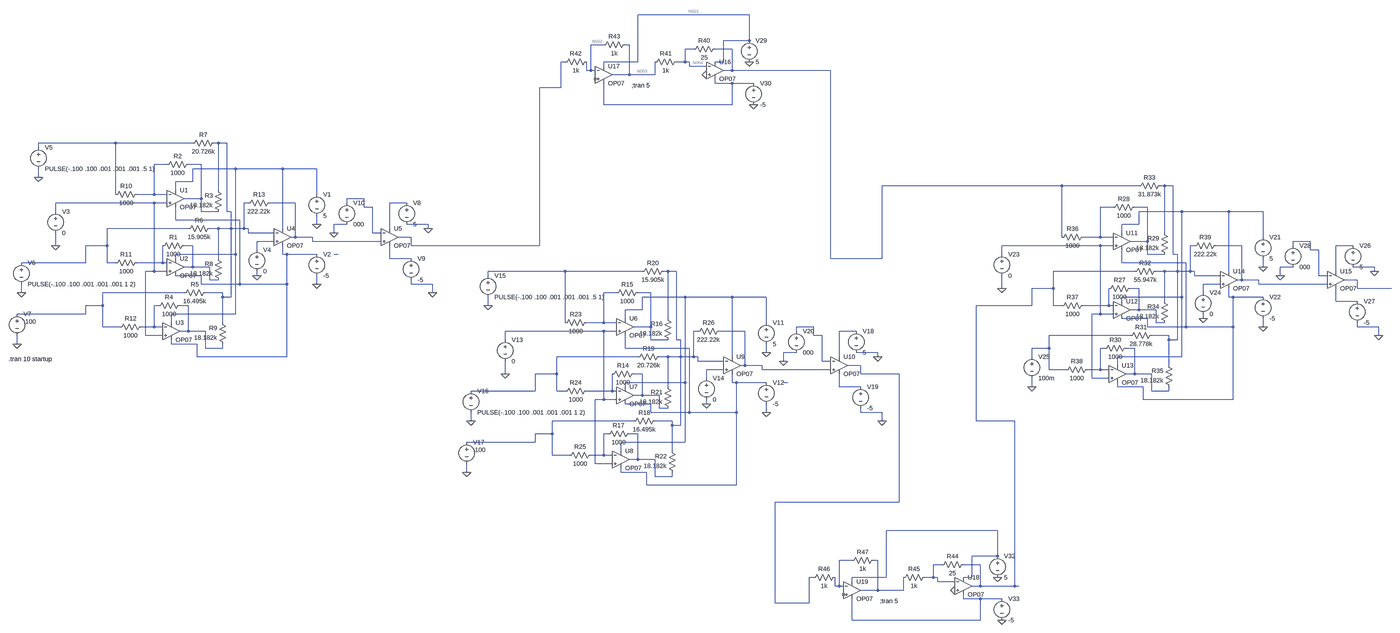
[diagram p0: schematic xor_with_resistor.asc, whole sheet]
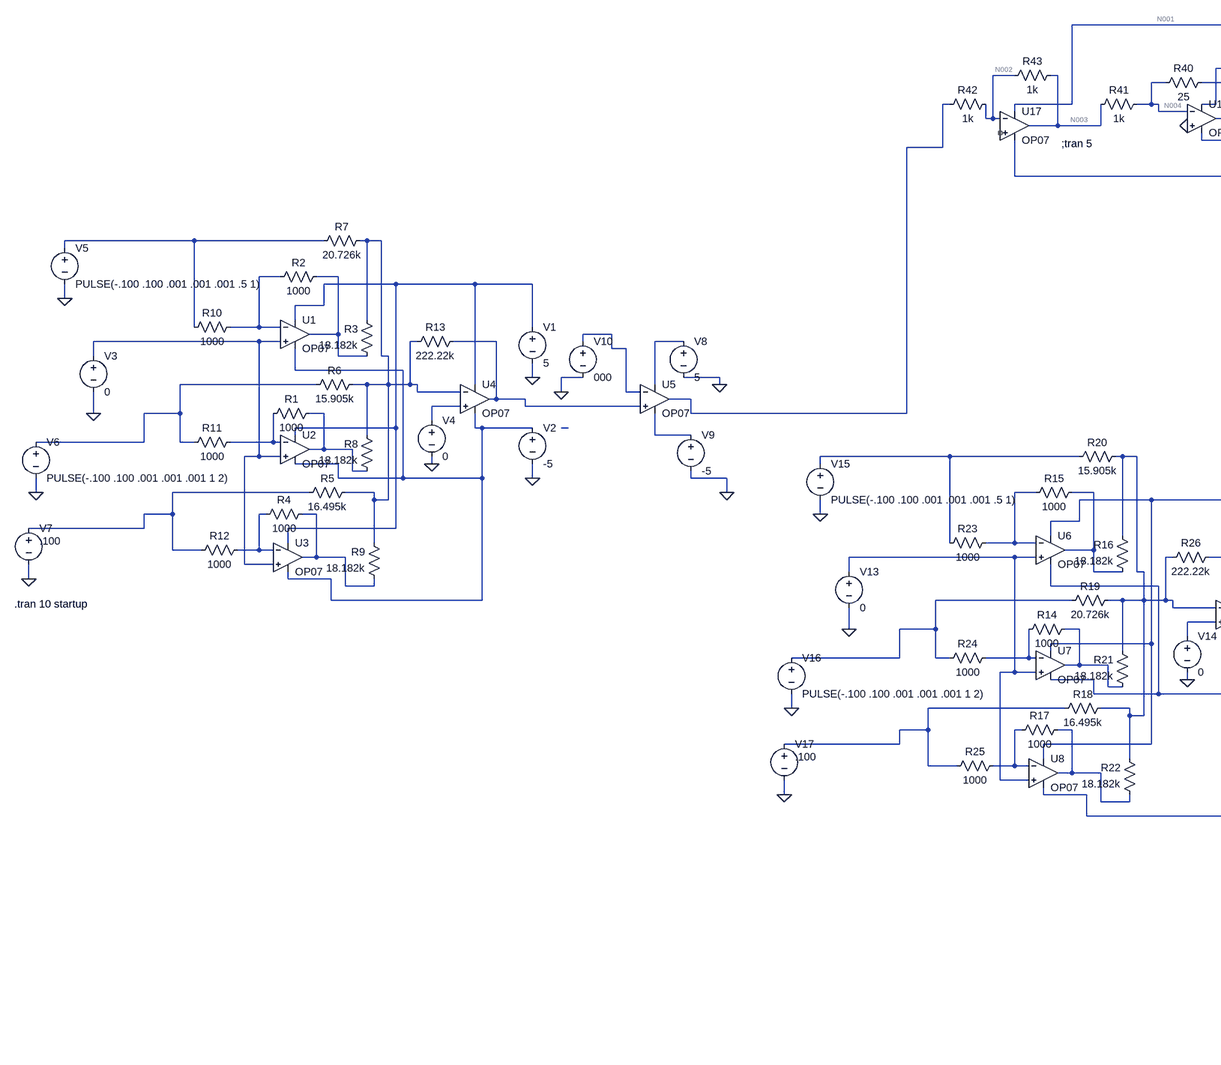
[diagram p1: schematic xor_with_resistor.asc, part, row 1 of 1, column 1 of 2]
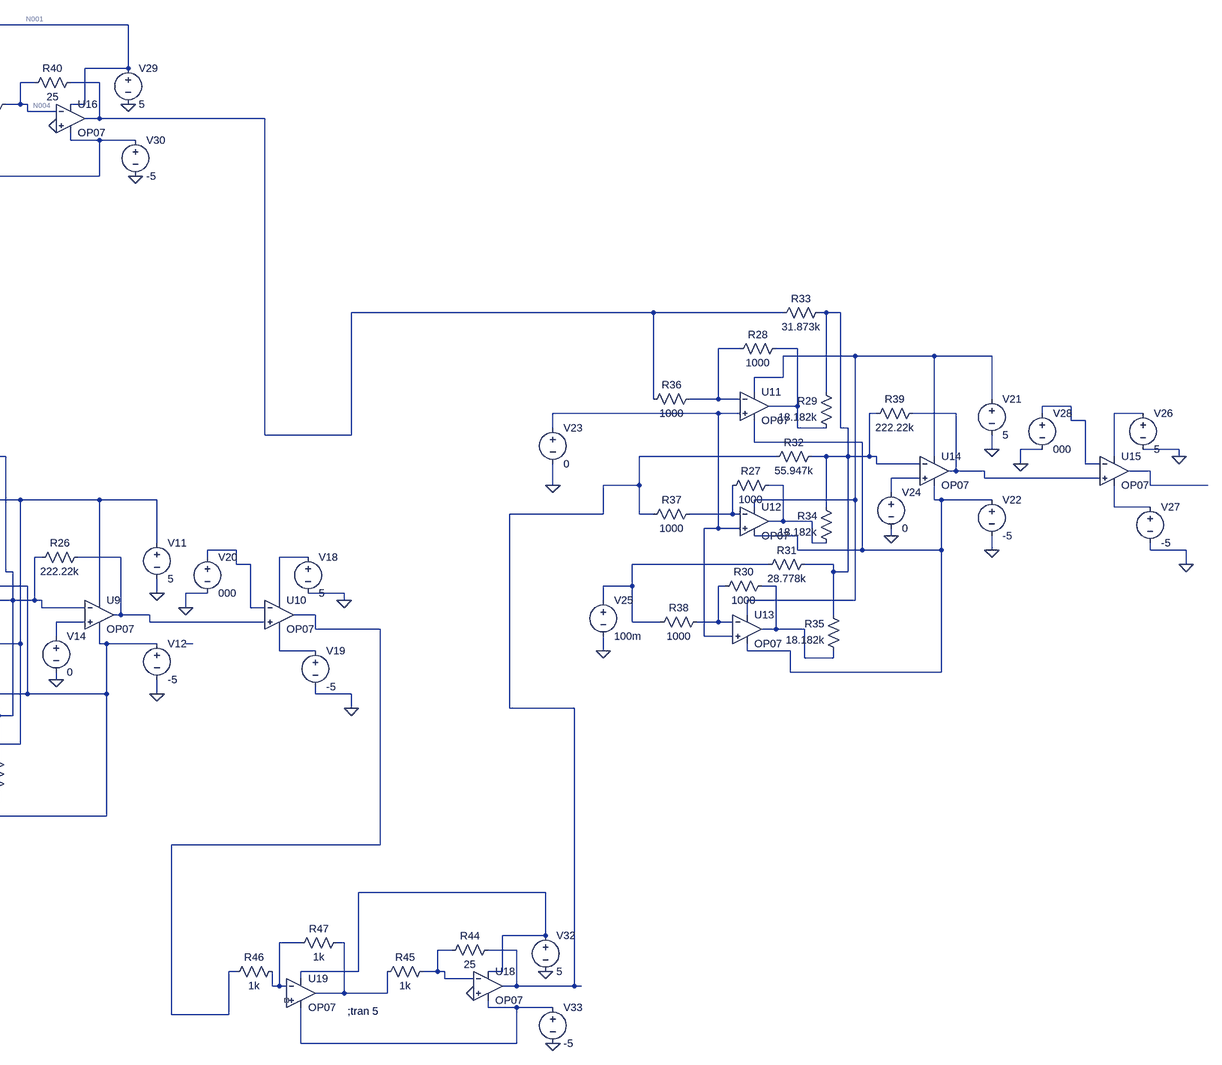
[diagram p2: schematic xor_with_resistor.asc, part, row 1 of 1, column 2 of 2]
xor_with_resistor.asc, the LTspice schematic file:
Version 4
SHEET 1 3268 1156
WIRE 864 -1184 448 -1184
WIRE 864 -1088 864 -1184
WIRE 864 -1088 768 -1088
WIRE 320 -1072 272 -1072
WIRE 416 -1072 400 -1072
WIRE 656 -1056 624 -1056
WIRE 800 -1056 736 -1056
WIRE 176 -1008 160 -1008
WIRE 448 -1008 448 -1184
WIRE 448 -1008 320 -1008
WIRE 624 -1008 624 -1056
WIRE 624 -1008 592 -1008
WIRE 640 -1008 624 -1008
WIRE 768 -1008 768 -1088
WIRE 768 -1008 736 -1008
WIRE 320 -992 320 -1008
WIRE 640 -992 640 -1008
WIRE 704 -992 640 -992
WIRE 256 -976 256 -1008
WIRE 272 -976 272 -1072
WIRE 272 -976 256 -976
WIRE 288 -976 272 -976
WIRE 800 -976 800 -1056
WIRE 800 -976 768 -976
WIRE 1168 -976 800 -976
WIRE 416 -960 416 -1072
WIRE 416 -960 352 -960
WIRE 512 -960 512 -1008
WIRE 512 -960 416 -960
WIRE 736 -928 736 -944
WIRE 800 -928 736 -928
WIRE 880 -928 800 -928
WIRE 160 -912 160 -1008
WIRE 160 -912 80 -912
WIRE 320 -848 320 -928
WIRE 800 -848 800 -928
WIRE 800 -848 320 -848
WIRE -1504 -704 -1792 -704
WIRE -1216 -704 -1504 -704
WIRE -1120 -704 -1136 -704
WIRE -1088 -704 -1120 -704
WIRE -1792 -688 -1792 -704
WIRE -1312 -624 -1360 -624
WIRE -1184 -624 -1232 -624
WIRE -1056 -608 -1216 -608
WIRE -880 -608 -1056 -608
WIRE -752 -608 -880 -608
WIRE -1792 -576 -1792 -608
WIRE -1216 -560 -1216 -608
WIRE -1216 -560 -1280 -560
WIRE 2032 -544 1360 -544
WIRE 2320 -544 2032 -544
WIRE 2416 -544 2400 -544
WIRE 2448 -544 2416 -544
WIRE -1280 -528 -1280 -560
WIRE -1120 -528 -1120 -704
WIRE -1504 -512 -1504 -704
WIRE -1360 -512 -1360 -624
WIRE -1360 -512 -1424 -512
WIRE -1312 -512 -1360 -512
WIRE -752 -512 -752 -608
WIRE -1184 -496 -1184 -624
WIRE -1184 -496 -1248 -496
WIRE -576 -496 -640 -496
WIRE -1360 -480 -1728 -480
WIRE -1312 -480 -1360 -480
WIRE -1008 -480 -1024 -480
WIRE -832 -480 -928 -480
WIRE -640 -480 -640 -496
WIRE -416 -480 -480 -480
WIRE -576 -464 -576 -496
WIRE -544 -464 -576 -464
WIRE 2224 -464 2176 -464
WIRE 2352 -464 2304 -464
WIRE -1728 -448 -1728 -480
WIRE -1184 -448 -1184 -496
WIRE -1120 -448 -1184 -448
WIRE -1088 -448 -1088 -704
WIRE -1072 -448 -1088 -448
WIRE 2480 -448 2320 -448
WIRE 2656 -448 2480 -448
WIRE 2784 -448 2656 -448
WIRE -1280 -416 -1280 -464
WIRE -1040 -416 -1280 -416
WIRE -752 -400 -752 -432
WIRE -640 -400 -688 -400
WIRE -336 -400 -416 -400
WIRE 2320 -400 2320 -448
WIRE 2320 -400 2256 -400
WIRE -1232 -384 -1536 -384
WIRE -1120 -384 -1152 -384
WIRE -1072 -384 -1072 -448
WIRE -1072 -384 -1120 -384
WIRE -1024 -384 -1024 -480
WIRE -1024 -384 -1072 -384
WIRE -1008 -384 -1024 -384
WIRE -880 -384 -880 -608
WIRE -480 -384 -480 -480
WIRE -336 -384 -336 -400
WIRE -1008 -368 -1008 -384
WIRE -912 -368 -1008 -368
WIRE -688 -368 -688 -400
WIRE -544 -368 -544 -464
WIRE -512 -368 -544 -368
WIRE 2256 -368 2256 -400
WIRE 2416 -368 2416 -544
WIRE -832 -352 -832 -480
WIRE -832 -352 -848 -352
WIRE -768 -352 -832 -352
WIRE -400 -352 -448 -352
WIRE 2032 -352 2032 -544
WIRE 2176 -352 2176 -464
WIRE 2176 -352 2112 -352
WIRE 2224 -352 2176 -352
WIRE 2784 -352 2784 -448
WIRE -912 -336 -976 -336
WIRE -768 -336 -768 -352
WIRE -512 -336 -768 -336
WIRE 2352 -336 2352 -464
WIRE 2352 -336 2288 -336
WIRE 2960 -336 2896 -336
WIRE -1728 -320 -1728 -368
WIRE -1536 -320 -1536 -384
WIRE -1536 -320 -1616 -320
WIRE -1216 -320 -1248 -320
WIRE -400 -320 -400 -352
WIRE 80 -320 80 -912
WIRE 80 -320 -400 -320
WIRE 2176 -320 1808 -320
WIRE 2224 -320 2176 -320
WIRE 2528 -320 2512 -320
WIRE 2704 -320 2608 -320
WIRE 2896 -320 2896 -336
WIRE 3120 -320 3056 -320
WIRE -976 -304 -976 -336
WIRE 2960 -304 2960 -336
WIRE 2992 -304 2960 -304
WIRE -1056 -288 -1056 -608
WIRE -1056 -288 -1280 -288
WIRE -880 -288 -880 -320
WIRE -864 -288 -880 -288
WIRE -752 -288 -864 -288
WIRE -672 -288 -688 -288
WIRE 1808 -288 1808 -320
WIRE 2352 -288 2352 -336
WIRE 2416 -288 2352 -288
WIRE 2448 -288 2448 -544
WIRE 2464 -288 2448 -288
WIRE -1280 -272 -1280 -288
WIRE -1120 -272 -1120 -384
WIRE -480 -272 -480 -320
WIRE -400 -272 -480 -272
WIRE 1168 -272 1168 -976
WIRE 1360 -272 1360 -544
WIRE 1360 -272 1168 -272
WIRE -1616 -256 -1616 -320
WIRE -1616 -256 -1856 -256
WIRE -1536 -256 -1536 -320
WIRE -1504 -256 -1536 -256
WIRE -1328 -256 -1328 -320
WIRE -1328 -256 -1424 -256
WIRE -1312 -256 -1328 -256
WIRE 2256 -256 2256 -304
WIRE 2496 -256 2256 -256
WIRE -1216 -240 -1216 -320
WIRE -1216 -240 -1248 -240
WIRE -1152 -240 -1216 -240
WIRE 2784 -240 2784 -272
WIRE 2896 -240 2848 -240
WIRE 3200 -240 3120 -240
WIRE -1360 -224 -1360 -480
WIRE -1360 -224 -1392 -224
WIRE -1312 -224 -1360 -224
WIRE 176 -224 -112 -224
WIRE 464 -224 176 -224
WIRE 560 -224 544 -224
WIRE 592 -224 560 -224
WIRE 2304 -224 2000 -224
WIRE 2416 -224 2384 -224
WIRE 2464 -224 2464 -288
WIRE 2464 -224 2416 -224
WIRE 2512 -224 2512 -320
WIRE 2512 -224 2464 -224
WIRE 2528 -224 2512 -224
WIRE 2656 -224 2656 -448
WIRE 3056 -224 3056 -320
WIRE 3200 -224 3200 -240
WIRE -1184 -208 -1280 -208
WIRE -976 -208 -976 -224
WIRE -112 -208 -112 -224
WIRE 2528 -208 2528 -224
WIRE 2624 -208 2528 -208
WIRE 2848 -208 2848 -240
WIRE 2992 -208 2992 -304
WIRE 3024 -208 2992 -208
WIRE -1152 -192 -1152 -240
WIRE -1120 -192 -1152 -192
WIRE 2704 -192 2704 -320
WIRE 2704 -192 2688 -192
WIRE 2768 -192 2704 -192
WIRE 3136 -192 3088 -192
WIRE -1184 -176 -1184 -208
WIRE -1040 -176 -1040 -416
WIRE -1040 -176 -1184 -176
WIRE -864 -176 -864 -288
WIRE -864 -176 -1040 -176
WIRE -752 -176 -752 -208
WIRE -400 -176 -400 -192
WIRE -320 -176 -400 -176
WIRE 2624 -176 2560 -176
WIRE 2768 -176 2768 -192
WIRE 3024 -176 2768 -176
WIRE 1808 -160 1808 -208
WIRE 2000 -160 2000 -224
WIRE 2000 -160 1920 -160
WIRE 2320 -160 2288 -160
WIRE 3136 -160 3136 -192
WIRE 3264 -160 3136 -160
WIRE -1856 -144 -1856 -176
WIRE -1248 -144 -1552 -144
WIRE -1104 -144 -1168 -144
WIRE -320 -144 -320 -176
WIRE 368 -144 320 -144
WIRE 496 -144 448 -144
WIRE 2560 -144 2560 -176
WIRE -1104 -128 -1104 -144
WIRE -1072 -128 -1072 -384
WIRE -1072 -128 -1104 -128
WIRE 624 -128 464 -128
WIRE 800 -128 624 -128
WIRE 928 -128 800 -128
WIRE 2480 -128 2480 -448
WIRE 2480 -128 2256 -128
WIRE 2656 -128 2656 -160
WIRE 2672 -128 2656 -128
WIRE 2784 -128 2672 -128
WIRE 2256 -112 2256 -128
WIRE 2416 -112 2416 -224
WIRE 3056 -112 3056 -160
WIRE 3136 -112 3056 -112
WIRE -1552 -96 -1552 -144
WIRE -1552 -96 -1616 -96
WIRE -1344 -96 -1360 -96
WIRE -1232 -96 -1264 -96
WIRE -112 -96 -112 -128
WIRE 1920 -96 1920 -160
WIRE 1920 -96 1712 -96
WIRE 2000 -96 2000 -160
WIRE 2032 -96 2000 -96
WIRE 2208 -96 2208 -160
WIRE 2208 -96 2112 -96
WIRE 2224 -96 2208 -96
WIRE 464 -80 464 -128
WIRE 464 -80 400 -80
WIRE 2320 -80 2320 -160
WIRE 2320 -80 2288 -80
WIRE 2384 -80 2320 -80
WIRE -1616 -64 -1616 -96
WIRE -1616 -64 -1872 -64
WIRE -1056 -64 -1056 -288
WIRE -1056 -64 -1296 -64
WIRE 2176 -64 2176 -320
WIRE 2176 -64 2144 -64
WIRE 2224 -64 2176 -64
WIRE 400 -48 400 -80
WIRE 560 -48 560 -224
WIRE 2352 -48 2256 -48
WIRE 2560 -48 2560 -64
WIRE -1296 -32 -1296 -64
WIRE -1104 -32 -1104 -128
WIRE 176 -32 176 -224
WIRE 320 -32 320 -144
WIRE 320 -32 256 -32
WIRE 368 -32 320 -32
WIRE 928 -32 928 -128
WIRE 2384 -32 2384 -80
WIRE 2416 -32 2384 -32
WIRE -1552 -16 -1552 -96
WIRE -1488 -16 -1552 -16
WIRE -1360 -16 -1360 -96
WIRE -1360 -16 -1408 -16
WIRE -1328 -16 -1360 -16
WIRE 496 -16 496 -144
WIRE 496 -16 432 -16
WIRE 1104 -16 1040 -16
WIRE 2352 -16 2352 -48
WIRE 2496 -16 2496 -256
WIRE 2496 -16 2352 -16
WIRE 2672 -16 2672 -128
WIRE 2672 -16 2496 -16
WIRE 2784 -16 2784 -48
WIRE 3136 -16 3136 -32
WIRE 3216 -16 3136 -16
WIRE -1232 0 -1232 -96
WIRE -1232 0 -1264 0
WIRE -1168 0 -1232 0
WIRE 320 0 -48 0
WIRE 368 0 320 0
WIRE 672 0 656 0
WIRE 848 0 752 0
WIRE 1040 0 1040 -16
WIRE 1264 0 1200 0
WIRE -1392 16 -1392 -224
WIRE -1328 16 -1392 16
WIRE 1104 16 1104 -16
WIRE 1136 16 1104 16
WIRE 2288 16 1984 16
WIRE 2432 16 2368 16
WIRE 3216 16 3216 -16
WIRE -48 32 -48 0
WIRE 496 32 496 -16
WIRE 560 32 496 32
WIRE 592 32 592 -224
WIRE 608 32 592 32
WIRE 2432 32 2432 16
WIRE 2464 32 2464 -224
WIRE 2464 32 2432 32
WIRE -1872 48 -1872 16
WIRE -1296 48 -1296 32
WIRE -1200 48 -1296 48
WIRE -1168 64 -1168 0
WIRE -1104 64 -1104 48
WIRE -1104 64 -1168 64
WIRE 400 64 400 16
WIRE 640 64 400 64
WIRE 1984 64 1984 16
WIRE 1984 64 1920 64
WIRE 2192 64 2176 64
WIRE 2304 64 2272 64
WIRE 928 80 928 48
WIRE 1040 80 992 80
WIRE 1344 80 1264 80
WIRE -1200 96 -1200 48
WIRE -864 96 -864 -176
WIRE -864 96 -1200 96
WIRE 448 96 144 96
WIRE 560 96 528 96
WIRE 608 96 608 32
WIRE 608 96 560 96
WIRE 656 96 656 0
WIRE 656 96 608 96
WIRE 672 96 656 96
WIRE 800 96 800 -128
WIRE 1200 96 1200 0
WIRE 1344 96 1344 80
WIRE 1920 96 1920 64
WIRE 2480 96 2480 -128
WIRE 2480 96 2240 96
WIRE 672 112 672 96
WIRE 768 112 672 112
WIRE 992 112 992 80
WIRE 1136 112 1136 16
WIRE 1168 112 1136 112
WIRE 848 128 848 0
WIRE 848 128 832 128
WIRE 912 128 848 128
WIRE 1280 128 1232 128
WIRE 2240 128 2240 96
WIRE 2432 128 2432 32
WIRE 768 144 704 144
WIRE 912 144 912 128
WIRE 1168 144 912 144
WIRE 1984 144 1984 64
WIRE 2048 144 1984 144
WIRE 2176 144 2176 64
WIRE 2176 144 2128 144
WIRE 2208 144 2176 144
WIRE -48 160 -48 112
WIRE 144 160 144 96
WIRE 144 160 64 160
WIRE 464 160 432 160
WIRE 1280 160 1280 128
WIRE 1424 160 1280 160
WIRE 2304 160 2304 64
WIRE 2304 160 2272 160
WIRE 2368 160 2304 160
WIRE 704 176 704 144
WIRE 2144 176 2144 -64
WIRE 2208 176 2144 176
WIRE 624 192 624 -128
WIRE 624 192 400 192
WIRE 800 192 800 160
WIRE 816 192 800 192
WIRE 928 192 816 192
WIRE 1008 192 992 192
WIRE 400 208 400 192
WIRE 560 208 560 96
WIRE 1200 208 1200 160
WIRE 1280 208 1200 208
WIRE 1920 208 1920 176
WIRE 2240 208 2240 192
WIRE 2336 208 2240 208
WIRE 64 224 64 160
WIRE 64 224 -176 224
WIRE 144 224 144 160
WIRE 176 224 144 224
WIRE 352 224 352 160
WIRE 352 224 256 224
WIRE 368 224 352 224
WIRE 2368 224 2368 160
WIRE 2432 224 2432 208
WIRE 2432 224 2368 224
WIRE 464 240 464 160
WIRE 464 240 432 240
WIRE 528 240 464 240
WIRE 320 256 320 0
WIRE 320 256 288 256
WIRE 368 256 320 256
WIRE 2336 256 2336 208
WIRE 2672 256 2672 -16
WIRE 2672 256 2336 256
WIRE 496 272 400 272
WIRE 704 272 704 256
WIRE 528 288 528 240
WIRE 560 288 528 288
WIRE 496 304 496 272
WIRE 640 304 640 64
WIRE 640 304 496 304
WIRE 816 304 816 192
WIRE 816 304 640 304
WIRE 928 304 928 272
WIRE 1280 304 1280 288
WIRE 1360 304 1280 304
WIRE -176 336 -176 304
WIRE 432 336 128 336
WIRE 576 336 512 336
WIRE 1360 336 1360 304
WIRE 1712 336 1712 -96
WIRE 1856 336 1712 336
WIRE 576 352 576 336
WIRE 608 352 608 96
WIRE 608 352 576 352
WIRE 128 384 128 336
WIRE 128 384 64 384
WIRE 336 384 320 384
WIRE 448 384 416 384
WIRE 64 416 64 384
WIRE 64 416 -192 416
WIRE 624 416 624 192
WIRE 624 416 384 416
WIRE 384 448 384 416
WIRE 576 448 576 352
WIRE 128 464 128 384
WIRE 192 464 128 464
WIRE 320 464 320 384
WIRE 320 464 272 464
WIRE 352 464 320 464
WIRE 448 480 448 384
WIRE 448 480 416 480
WIRE 512 480 448 480
WIRE 288 496 288 256
WIRE 352 496 288 496
WIRE -192 528 -192 496
WIRE 384 528 384 512
WIRE 480 528 384 528
WIRE 512 544 512 480
WIRE 576 544 576 528
WIRE 576 544 512 544
WIRE 480 576 480 528
WIRE 816 576 816 304
WIRE 816 576 480 576
WIRE 1424 640 1424 160
WIRE 1424 640 960 640
WIRE 1792 784 1376 784
WIRE 1792 880 1792 784
WIRE 1792 880 1696 880
WIRE 1248 896 1200 896
WIRE 1344 896 1328 896
WIRE 1584 912 1552 912
WIRE 1728 912 1664 912
WIRE 1104 960 1088 960
WIRE 1376 960 1376 784
WIRE 1376 960 1248 960
WIRE 1552 960 1552 912
WIRE 1552 960 1520 960
WIRE 1568 960 1552 960
WIRE 1696 960 1696 880
WIRE 1696 960 1664 960
WIRE 1248 976 1248 960
WIRE 1568 976 1568 960
WIRE 1632 976 1568 976
WIRE 1184 992 1184 960
WIRE 1200 992 1200 896
WIRE 1200 992 1184 992
WIRE 1216 992 1200 992
WIRE 1728 992 1728 912
WIRE 1728 992 1696 992
WIRE 1856 992 1856 336
WIRE 1856 992 1728 992
WIRE 1872 992 1856 992
WIRE 1344 1008 1344 896
WIRE 1344 1008 1280 1008
WIRE 1440 1008 1440 960
WIRE 1440 1008 1344 1008
WIRE 1664 1040 1664 1024
WIRE 1728 1040 1664 1040
WIRE 1808 1040 1728 1040
WIRE 960 1056 960 640
WIRE 1088 1056 1088 960
WIRE 1088 1056 960 1056
WIRE 1248 1120 1248 1040
WIRE 1728 1120 1728 1040
WIRE 1728 1120 1248 1120
FLAG -752 -400 0
FLAG -752 -176 0
FLAG -1728 -320 0
FLAG -976 -208 0
FLAG -1792 -576 0
FLAG -1856 -144 0
FLAG -1872 48 0
FLAG -336 -384 0
FLAG -320 -144 0
FLAG -688 -368 0
FLAG 928 80 0
FLAG 928 304 0
FLAG -48 160 0
FLAG 704 272 0
FLAG -112 -96 0
FLAG -176 336 0
FLAG -192 528 0
FLAG 1344 96 0
FLAG 1360 336 0
FLAG 992 112 0
FLAG 2784 -240 0
FLAG 2784 -16 0
FLAG 1808 -160 0
FLAG 2560 -48 0
FLAG 3200 -224 0
FLAG 3216 16 0
FLAG 2848 -208 0
FLAG 1920 208 0
FLAG 864 -1008 0
FLAG 880 -848 0
FLAG 704 -960 0
FLAG 1792 960 0
FLAG 1808 1120 0
FLAG 1632 1008 0
SYMBOL Opamps\\OP07 -1280 -560 R0
SYMATTR InstName U1
SYMBOL Opamps\\OP07 -1280 -304 R0
SYMATTR InstName U2
SYMBOL Opamps\\OP07 -1296 -64 R0
SYMATTR InstName U3
SYMBOL Opamps\\OP07 -880 -416 R0
SYMATTR InstName U4
SYMBOL voltage -752 -528 R0
WINDOW 123 0 0 Left 2
WINDOW 39 0 0 Left 2
SYMATTR InstName V1
SYMATTR Value 5
SYMBOL voltage -752 -304 R0
WINDOW 123 0 0 Left 2
WINDOW 39 0 0 Left 2
SYMATTR InstName V2
SYMATTR Value -5
SYMBOL res -1232 -336 R90
WINDOW 0 0 56 VBottom 2
WINDOW 3 32 56 VTop 2
SYMATTR InstName R1
SYMATTR Value 1000
SYMBOL res -1216 -640 R90
WINDOW 0 0 56 VBottom 2
WINDOW 3 32 56 VTop 2
SYMATTR InstName R2
SYMATTR Value 1000
SYMBOL res -1104 -432 R180
WINDOW 0 36 76 Left 2
WINDOW 3 36 40 Left 2
SYMATTR InstName R3
SYMATTR Value 18.182k
SYMBOL res -1248 -112 R90
WINDOW 0 0 56 VBottom 2
WINDOW 3 32 56 VTop 2
SYMATTR InstName R4
SYMATTR Value 1000
SYMBOL res -1152 -160 R90
WINDOW 0 0 56 VBottom 2
WINDOW 3 32 56 VTop 2
SYMATTR InstName R5
SYMATTR Value 16.495k
SYMBOL res -1136 -400 R90
WINDOW 0 0 56 VBottom 2
WINDOW 3 32 56 VTop 2
SYMATTR InstName R6
SYMATTR Value 15.905k
SYMBOL res -1120 -720 R90
WINDOW 0 0 56 VBottom 2
WINDOW 3 32 56 VTop 2
SYMATTR InstName R7
SYMATTR Value 20.726k
SYMBOL res -1104 -176 R180
WINDOW 0 36 76 Left 2
WINDOW 3 36 40 Left 2
SYMATTR InstName R8
SYMATTR Value 18.182k
SYMBOL res -1088 64 R180
WINDOW 0 36 76 Left 2
WINDOW 3 36 40 Left 2
SYMATTR InstName R9
SYMATTR Value 18.182k
SYMBOL res -1408 -528 R90
WINDOW 0 0 56 VBottom 2
WINDOW 3 32 56 VTop 2
SYMATTR InstName R10
SYMATTR Value 1000
SYMBOL res -1408 -272 R90
WINDOW 0 0 56 VBottom 2
WINDOW 3 32 56 VTop 2
SYMATTR InstName R11
SYMATTR Value 1000
SYMBOL res -1392 -32 R90
WINDOW 0 0 56 VBottom 2
WINDOW 3 32 56 VTop 2
SYMATTR InstName R12
SYMATTR Value 1000
SYMBOL res -912 -496 R90
WINDOW 0 0 56 VBottom 2
WINDOW 3 32 56 VTop 2
SYMATTR InstName R13
SYMATTR Value 222.22k
SYMBOL voltage -1728 -464 R0
WINDOW 123 0 0 Left 2
WINDOW 39 0 0 Left 2
SYMATTR InstName V3
SYMATTR Value 0
SYMBOL voltage -976 -320 R0
WINDOW 123 0 0 Left 2
WINDOW 39 0 0 Left 2
SYMATTR InstName V4
SYMATTR Value 0
SYMBOL voltage -1792 -704 R0
WINDOW 123 0 0 Left 2
WINDOW 39 0 0 Left 2
SYMATTR InstName V5
SYMATTR Value PULSE(-.100 .100 .001 .001 .001 .5 1)
SYMBOL voltage -1856 -272 R0
WINDOW 123 0 0 Left 2
WINDOW 39 0 0 Left 2
SYMATTR InstName V6
SYMATTR Value PULSE(-.100 .100 .001 .001 .001 1 2)
SYMBOL voltage -1872 -80 R0
WINDOW 3 24 44 Left 2
WINDOW 123 0 0 Left 2
WINDOW 39 0 0 Left 2
SYMATTR Value .100
SYMATTR InstName V7
SYMBOL Opamps\\OP07 -480 -416 R0
SYMATTR InstName U5
SYMBOL voltage -416 -496 R0
WINDOW 123 0 0 Left 2
WINDOW 39 0 0 Left 2
SYMATTR InstName V8
SYMATTR Value 5
SYMBOL voltage -400 -288 R0
WINDOW 123 0 0 Left 2
WINDOW 39 0 0 Left 2
SYMATTR InstName V9
SYMATTR Value -5
SYMBOL voltage -640 -496 R0
WINDOW 123 0 0 Left 2
WINDOW 39 0 0 Left 2
SYMATTR InstName V10
SYMATTR Value 000
SYMBOL Opamps\\OP07 400 -80 R0
SYMATTR InstName U6
SYMBOL Opamps\\OP07 400 176 R0
SYMATTR InstName U7
SYMBOL Opamps\\OP07 384 416 R0
SYMATTR InstName U8
SYMBOL Opamps\\OP07 800 64 R0
SYMATTR InstName U9
SYMBOL voltage 928 -48 R0
WINDOW 123 0 0 Left 2
WINDOW 39 0 0 Left 2
SYMATTR InstName V11
SYMATTR Value 5
SYMBOL voltage 928 176 R0
WINDOW 123 0 0 Left 2
WINDOW 39 0 0 Left 2
SYMATTR InstName V12
SYMATTR Value -5
SYMBOL res 448 144 R90
WINDOW 0 0 56 VBottom 2
WINDOW 3 32 56 VTop 2
SYMATTR InstName R14
SYMATTR Value 1000
SYMBOL res 464 -160 R90
WINDOW 0 0 56 VBottom 2
WINDOW 3 32 56 VTop 2
SYMATTR InstName R15
SYMATTR Value 1000
SYMBOL res 576 48 R180
WINDOW 0 36 76 Left 2
WINDOW 3 36 40 Left 2
SYMATTR InstName R16
SYMATTR Value 18.182k
SYMBOL res 432 368 R90
WINDOW 0 0 56 VBottom 2
WINDOW 3 32 56 VTop 2
SYMATTR InstName R17
SYMATTR Value 1000
SYMBOL res 528 320 R90
WINDOW 0 0 56 VBottom 2
WINDOW 3 32 56 VTop 2
SYMATTR InstName R18
SYMATTR Value 16.495k
SYMBOL res 544 80 R90
WINDOW 0 0 56 VBottom 2
WINDOW 3 32 56 VTop 2
SYMATTR InstName R19
SYMATTR Value 20.726k
SYMBOL res 560 -240 R90
WINDOW 0 0 56 VBottom 2
WINDOW 3 32 56 VTop 2
SYMATTR InstName R20
SYMATTR Value 15.905k
SYMBOL res 576 304 R180
WINDOW 0 36 76 Left 2
WINDOW 3 36 40 Left 2
SYMATTR InstName R21
SYMATTR Value 18.182k
SYMBOL res 592 544 R180
WINDOW 0 36 76 Left 2
WINDOW 3 36 40 Left 2
SYMATTR InstName R22
SYMATTR Value 18.182k
SYMBOL res 272 -48 R90
WINDOW 0 0 56 VBottom 2
WINDOW 3 32 56 VTop 2
SYMATTR InstName R23
SYMATTR Value 1000
SYMBOL res 272 208 R90
WINDOW 0 0 56 VBottom 2
WINDOW 3 32 56 VTop 2
SYMATTR InstName R24
SYMATTR Value 1000
SYMBOL res 288 448 R90
WINDOW 0 0 56 VBottom 2
WINDOW 3 32 56 VTop 2
SYMATTR InstName R25
SYMATTR Value 1000
SYMBOL res 768 -16 R90
WINDOW 0 0 56 VBottom 2
WINDOW 3 32 56 VTop 2
SYMATTR InstName R26
SYMATTR Value 222.22k
SYMBOL voltage -48 16 R0
WINDOW 123 0 0 Left 2
WINDOW 39 0 0 Left 2
SYMATTR InstName V13
SYMATTR Value 0
SYMBOL voltage 704 160 R0
WINDOW 123 0 0 Left 2
WINDOW 39 0 0 Left 2
SYMATTR InstName V14
SYMATTR Value 0
SYMBOL voltage -112 -224 R0
WINDOW 123 0 0 Left 2
WINDOW 39 0 0 Left 2
SYMATTR InstName V15
SYMATTR Value PULSE(-.100 .100 .001 .001 .001 .5 1)
SYMBOL voltage -176 208 R0
WINDOW 123 0 0 Left 2
WINDOW 39 0 0 Left 2
SYMATTR InstName V16
SYMATTR Value PULSE(-.100 .100 .001 .001 .001 1 2)
SYMBOL voltage -192 400 R0
WINDOW 3 24 44 Left 2
WINDOW 123 0 0 Left 2
WINDOW 39 0 0 Left 2
SYMATTR Value .100
SYMATTR InstName V17
SYMBOL Opamps\\OP07 1200 64 R0
SYMATTR InstName U10
SYMBOL voltage 1264 -16 R0
WINDOW 123 0 0 Left 2
WINDOW 39 0 0 Left 2
SYMATTR InstName V18
SYMATTR Value 5
SYMBOL voltage 1280 192 R0
WINDOW 123 0 0 Left 2
WINDOW 39 0 0 Left 2
SYMATTR InstName V19
SYMATTR Value -5
SYMBOL voltage 1040 -16 R0
WINDOW 123 0 0 Left 2
WINDOW 39 0 0 Left 2
SYMATTR InstName V20
SYMATTR Value 000
SYMBOL Opamps\\OP07 2256 -400 R0
SYMATTR InstName U11
SYMBOL Opamps\\OP07 2256 -144 R0
SYMATTR InstName U12
SYMBOL Opamps\\OP07 2240 96 R0
SYMATTR InstName U13
SYMBOL Opamps\\OP07 2656 -256 R0
SYMATTR InstName U14
SYMBOL voltage 2784 -368 R0
WINDOW 123 0 0 Left 2
WINDOW 39 0 0 Left 2
SYMATTR InstName V21
SYMATTR Value 5
SYMBOL voltage 2784 -144 R0
WINDOW 123 0 0 Left 2
WINDOW 39 0 0 Left 2
SYMATTR InstName V22
SYMATTR Value -5
SYMBOL res 2304 -176 R90
WINDOW 0 0 56 VBottom 2
WINDOW 3 32 56 VTop 2
SYMATTR InstName R27
SYMATTR Value 1000
SYMBOL res 2320 -480 R90
WINDOW 0 0 56 VBottom 2
WINDOW 3 32 56 VTop 2
SYMATTR InstName R28
SYMATTR Value 1000
SYMBOL res 2432 -272 R180
WINDOW 0 36 76 Left 2
WINDOW 3 36 40 Left 2
SYMATTR InstName R29
SYMATTR Value 18.182k
SYMBOL res 2288 48 R90
WINDOW 0 0 56 VBottom 2
WINDOW 3 32 56 VTop 2
SYMATTR InstName R30
SYMATTR Value 1000
SYMBOL res 2384 0 R90
WINDOW 0 0 56 VBottom 2
WINDOW 3 32 56 VTop 2
SYMATTR InstName R31
SYMATTR Value 28.778k
SYMBOL res 2400 -240 R90
WINDOW 0 0 56 VBottom 2
WINDOW 3 32 56 VTop 2
SYMATTR InstName R32
SYMATTR Value 55.947k
SYMBOL res 2416 -560 R90
WINDOW 0 0 56 VBottom 2
WINDOW 3 32 56 VTop 2
SYMATTR InstName R33
SYMATTR Value 31.873k
SYMBOL res 2432 -16 R180
WINDOW 0 36 76 Left 2
WINDOW 3 36 40 Left 2
SYMATTR InstName R34
SYMATTR Value 18.182k
SYMBOL res 2448 224 R180
WINDOW 0 36 76 Left 2
WINDOW 3 36 40 Left 2
SYMATTR InstName R35
SYMATTR Value 18.182k
SYMBOL res 2128 -368 R90
WINDOW 0 0 56 VBottom 2
WINDOW 3 32 56 VTop 2
SYMATTR InstName R36
SYMATTR Value 1000
SYMBOL res 2128 -112 R90
WINDOW 0 0 56 VBottom 2
WINDOW 3 32 56 VTop 2
SYMATTR InstName R37
SYMATTR Value 1000
SYMBOL res 2144 128 R90
WINDOW 0 0 56 VBottom 2
WINDOW 3 32 56 VTop 2
SYMATTR InstName R38
SYMATTR Value 1000
SYMBOL res 2624 -336 R90
WINDOW 0 0 56 VBottom 2
WINDOW 3 32 56 VTop 2
SYMATTR InstName R39
SYMATTR Value 222.22k
SYMBOL voltage 1808 -304 R0
WINDOW 123 0 0 Left 2
WINDOW 39 0 0 Left 2
SYMATTR InstName V23
SYMATTR Value 0
SYMBOL voltage 2560 -160 R0
WINDOW 123 0 0 Left 2
WINDOW 39 0 0 Left 2
SYMATTR InstName V24
SYMATTR Value 0
SYMBOL Opamps\\OP07 3056 -256 R0
SYMATTR InstName U15
SYMBOL voltage 3120 -336 R0
WINDOW 123 0 0 Left 2
WINDOW 39 0 0 Left 2
SYMATTR InstName V26
SYMATTR Value 5
SYMBOL voltage 3136 -128 R0
WINDOW 123 0 0 Left 2
WINDOW 39 0 0 Left 2
SYMATTR InstName V27
SYMATTR Value -5
SYMBOL voltage 2896 -336 R0
WINDOW 123 0 0 Left 2
WINDOW 39 0 0 Left 2
SYMATTR InstName V28
SYMATTR Value 000
SYMBOL voltage 1920 80 R0
WINDOW 123 0 0 Left 2
WINDOW 39 0 0 Left 2
SYMATTR InstName V25
SYMATTR Value 100m
SYMBOL Opamps\\OP07 736 -1040 R0
SYMATTR InstName U16
SYMBOL voltage 864 -1104 R0
WINDOW 123 0 0 Left 2
WINDOW 39 0 0 Left 2
SYMATTR InstName V29
SYMATTR Value 5
SYMBOL voltage 880 -944 R0
WINDOW 123 0 0 Left 2
WINDOW 39 0 0 Left 2
SYMATTR InstName V30
SYMATTR Value -5
SYMBOL res 752 -1072 R90
WINDOW 0 0 56 VBottom 2
WINDOW 3 32 56 VTop 2
SYMATTR InstName R40
SYMATTR Value 25
SYMBOL res 608 -1024 R90
WINDOW 0 0 56 VBottom 2
WINDOW 3 32 56 VTop 2
SYMATTR InstName R41
SYMATTR Value 1k
SYMBOL Opamps\\OP07 320 -1024 R0
SYMATTR InstName U17
SYMBOL res 272 -1024 R90
WINDOW 0 0 56 VBottom 2
WINDOW 3 32 56 VTop 2
SYMATTR InstName R42
SYMATTR Value 1k
SYMBOL res 416 -1088 R90
WINDOW 0 0 56 VBottom 2
WINDOW 3 32 56 VTop 2
SYMATTR InstName R43
SYMATTR Value 1k
SYMBOL Opamps\\OP07 1664 928 R0
SYMATTR InstName U18
SYMBOL voltage 1792 864 R0
WINDOW 123 0 0 Left 2
WINDOW 39 0 0 Left 2
SYMATTR InstName V32
SYMATTR Value 5
SYMBOL voltage 1808 1024 R0
WINDOW 123 0 0 Left 2
WINDOW 39 0 0 Left 2
SYMATTR InstName V33
SYMATTR Value -5
SYMBOL res 1680 896 R90
WINDOW 0 0 56 VBottom 2
WINDOW 3 32 56 VTop 2
SYMATTR InstName R44
SYMATTR Value 25
SYMBOL res 1536 944 R90
WINDOW 0 0 56 VBottom 2
WINDOW 3 32 56 VTop 2
SYMATTR InstName R45
SYMATTR Value 1k
SYMBOL Opamps\\OP07 1248 944 R0
SYMATTR InstName U19
SYMBOL res 1200 944 R90
WINDOW 0 0 56 VBottom 2
WINDOW 3 32 56 VTop 2
SYMATTR InstName R46
SYMATTR Value 1k
SYMBOL res 1344 880 R90
WINDOW 0 0 56 VBottom 2
WINDOW 3 32 56 VTop 2
SYMATTR InstName R47
SYMATTR Value 1k
TEXT -1904 104 Left 2 !.tran 10 startup
TEXT 424 -920 Left 2 !;tran 5
TEXT 1352 1048 Left 2 !;tran 5

The netlist it stands for:
* xor_with_resistor.asc
XU1 N015 N010 N012 N021 N011 LT1001  ; OP07, pins In+ In- V+ V- OUT
XU2 N015 N031 N012 N021 N025 LT1001  ; OP07, pins In+ In- V+ V- OUT
XU3 N015 N044 N012 N021 N045 LT1001  ; OP07, pins In+ In- V+ V- OUT
XU4 N023 N009 N012 N021 N016 LT1001  ; OP07, pins In+ In- V+ V- OUT
V1 N012 0 5
V2 N021 0 -5
R1 N025 N031 1000
R2 N011 N010 1000
R3 N011 N009 18.182k
R4 N045 N044 1000
R5 N009 N039 16.495k
R6 N009 N022 15.905k
R7 N009 N008 20.726k
R8 N025 N009 18.182k
R9 N045 N009 18.182k
R10 N010 N008 1000
R11 N031 N022 1000
R12 N044 N039 1000
R13 N016 N009 222.22k
V3 N015 0 0
V4 N023 0 0
V5 N008 0 PULSE(-.100 .100 .001 .001 .001 .5 1)
V6 N022 0 PULSE(-.100 .100 .001 .001 .001 1 2)
V7 N039 0 .100
XU5 N016 N014 N017 N030 N006 LT1001  ; OP07, pins In+ In- V+ V- OUT
V8 N017 0 5
V9 N030 0 -5
V10 N014 0 000
XU6 N048 N040 N042 N052 N041 LT1001  ; OP07, pins In+ In- V+ V- OUT
XU7 N048 N061 N042 N052 N058 LT1001  ; OP07, pins In+ In- V+ V- OUT
XU8 N048 N063 N042 N052 N064 LT1001  ; OP07, pins In+ In- V+ V- OUT
XU9 N057 N034 N042 N052 N049 LT1001  ; OP07, pins In+ In- V+ V- OUT
V11 N042 0 5
V12 N052 0 -5
R14 N058 N061 1000
R15 N041 N040 1000
R16 N041 N034 18.182k
R17 N064 N063 1000
R18 N034 N062 16.495k
R19 N034 N055 20.726k
R20 N034 N033 15.905k
R21 N058 N034 18.182k
R22 N064 N034 18.182k
R23 N040 N033 1000
R24 N061 N055 1000
R25 N063 N062 1000
R26 N049 N034 222.22k
V13 N048 0 0
V14 N057 0 0
V15 N033 0 PULSE(-.100 .100 .001 .001 .001 .5 1)
V16 N055 0 PULSE(-.100 .100 .001 .001 .001 1 2)
V17 N062 0 .100
XU10 N049 N047 N050 N060 N056 LT1001  ; OP07, pins In+ In- V+ V- OUT
V18 N050 0 5
V19 N060 0 -5
V20 N047 0 000
XU11 N026 N018 N020 N032 N019 LT1001  ; OP07, pins In+ In- V+ V- OUT
XU12 N026 N046 N020 N032 N038 LT1001  ; OP07, pins In+ In- V+ V- OUT
XU13 N026 N053 N020 N032 N054 LT1001  ; OP07, pins In+ In- V+ V- OUT
XU14 N037 N013 N020 N032 N027 LT1001  ; OP07, pins In+ In- V+ V- OUT
V21 N020 0 5
V22 N032 0 -5
R27 N038 N046 1000
R28 N019 N018 1000
R29 N019 N013 18.182k
R30 N054 N053 1000
R31 N013 N051 28.778k
R32 N013 N035 55.947k
R33 N013 N005 31.873k
R34 N038 N013 18.182k
R35 N054 N013 18.182k
R36 N018 N005 1000
R37 N046 N035 1000
R38 N053 N051 1000
R39 N027 N013 222.22k
V23 N026 0 0
V24 N037 0 0
XU15 N027 N024 N028 N043 N036 LT1001  ; OP07, pins In+ In- V+ V- OUT
V26 N028 0 5
V27 N043 0 -5
V28 N024 0 000
V25 N051 0 100m
XU16 0 N004 N001 N007 N005 LT1001  ; OP07, pins In+ In- V+ V- OUT
V29 N001 0 5
V30 N007 0 -5
R40 N005 N004 25
R41 N004 N003 1k
XU17 NC_01 N002 N001 N007 N003 LT1001  ; OP07, pins In+ In- V+ V- OUT
R42 N002 N006 1k
R43 N003 N002 1k
XU18 0 N068 N065 N069 N035 LT1001  ; OP07, pins In+ In- V+ V- OUT
V32 N065 0 5
V33 N069 0 -5
R44 N035 N068 25
R45 N068 N067 1k
XU19 NC_02 N066 N065 N069 N067 LT1001  ; OP07, pins In+ In- V+ V- OUT
R46 N066 N056 1k
R47 N067 N066 1k
.tran 10 startup
;tran 5
;tran 5
.lib LTC.lib
.backanno
.end

* Results of the author's LTspice run, read from the files saved beside the schematic
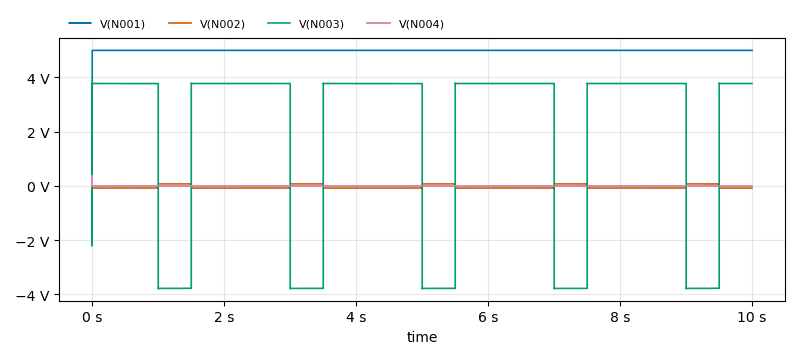
[diagram p3: Transient Analysis of xor_with_resistor.asc, plotted from the saved traces]
* Transient Analysis, 1 run:
*   V(N001): min 0 V, max 5 V, average 5 V, rms 5 V, last 5 V
*   V(N002): min -148.7 mV, max 495.1 mV, average -38.64 mV, rms 77.33 mV, last -77.29 mV
*   V(N003): min -3.792 V, max 3.792 V, average 1.888 V, rms 3.778 V, last 3.778 V
*   V(N004): min -11.49 mV, max 390.6 mV, average 329 nV, rms 210.5 µV, last 301.8 nV